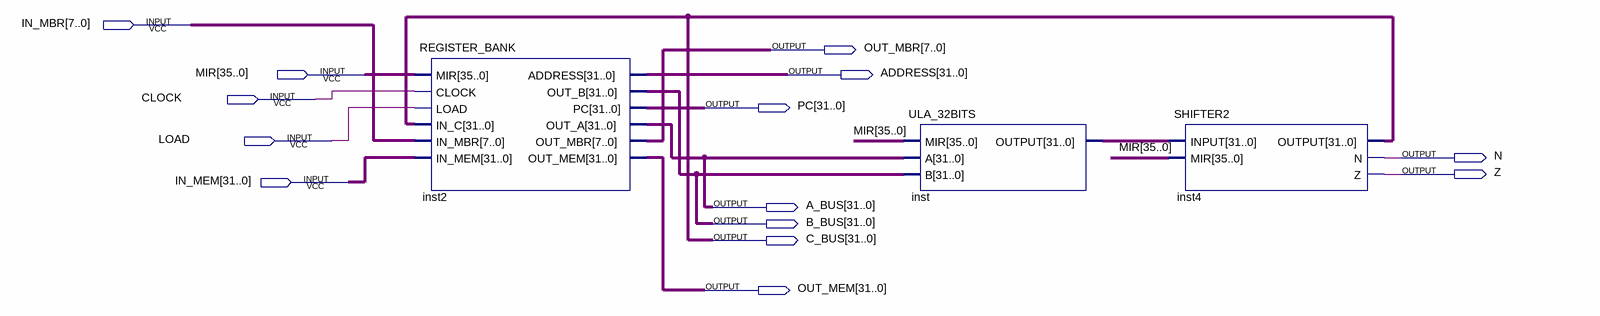
[diagram p0: schematic sheet]
// Quartus schematic datapath.bdf as structural Verilog: 3 symbols, 14 pins
module datapath (
  input  [7:0] IN_MBR,
  input  [35:0] MIR,
  input  CLOCK,
  input  LOAD,
  input  [31:0] IN_MEM,
  output [7:0] OUT_MBR,
  output [31:0] ADDRESS,
  output [31:0] PC,
  output N,
  output Z,
  output [31:0] A_BUS,
  output [31:0] B_BUS,
  output [31:0] C_BUS,
  output [31:0] OUT_MEM
);

  wire [31:0] inst_output;

  REGISTER_BANK inst2 (
    .MIR(MIR), .CLOCK(CLOCK), .LOAD(LOAD), .IN_C(C_BUS), .IN_MBR(IN_MBR), .IN_MEM(IN_MEM), .ADDRESS(ADDRESS),
    .OUT_B(B_BUS), .PC(PC), .OUT_A(A_BUS), .OUT_MBR(OUT_MBR), .OUT_MEM(OUT_MEM));
  ULA_32BITS inst (.MIR(MIR), .A(A_BUS), .B(B_BUS), .OUTPUT(inst_output));
  SHIFTER2 inst4 (.INPUT(inst_output), .MIR(MIR), .OUTPUT(C_BUS), .N(N), .Z(Z));
endmodule
